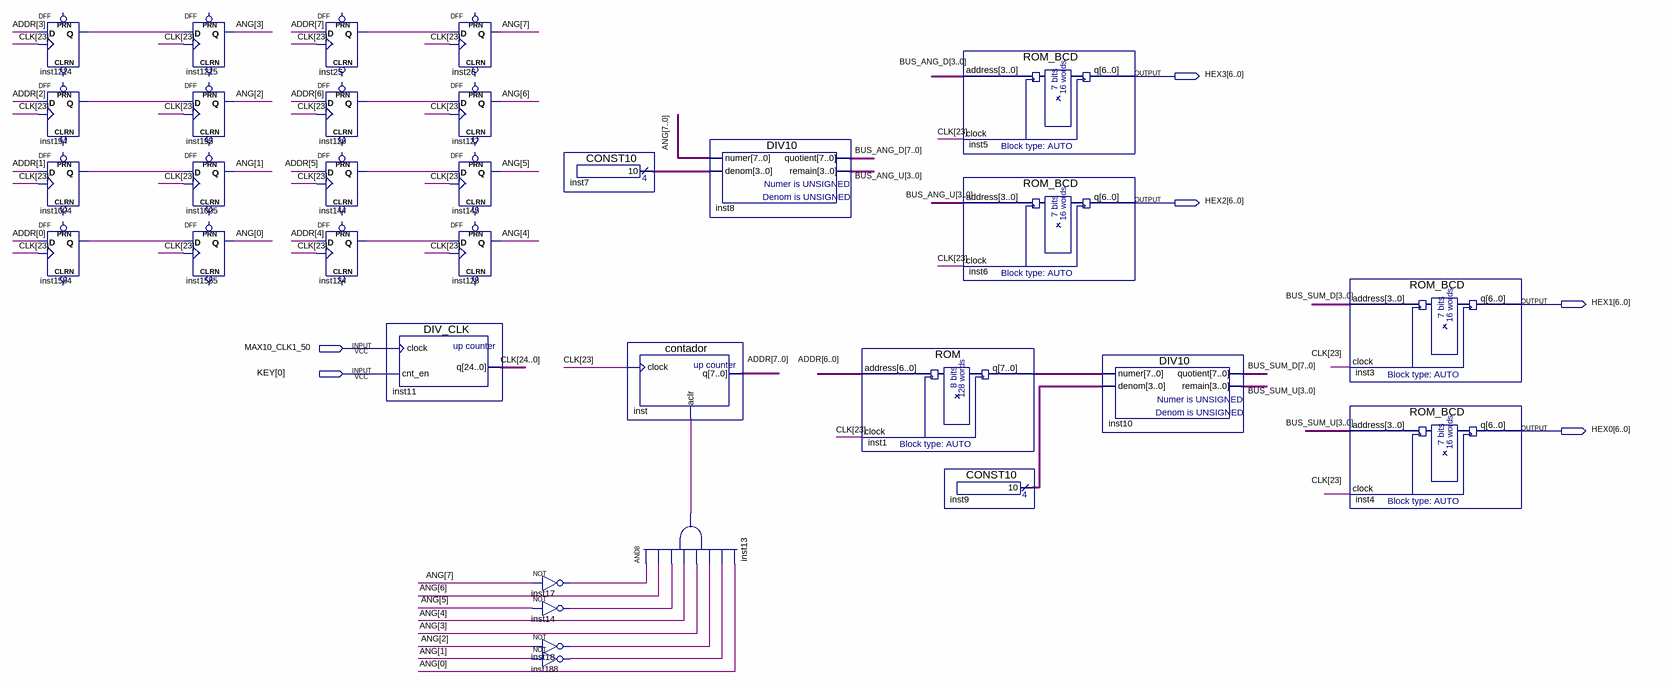
[diagram p0: schematic sheet]
// Quartus schematic sincos.bdf as structural Verilog: 32 symbols, 6 pins
module sincos (
  input  MAX10_CLK1_50,
  input  [0:0] KEY,
  output [6:0] HEX3,
  output [6:0] HEX2,
  output [6:0] HEX1,
  output [6:0] HEX0
);

  wire inst13_out, inst14_out, inst17_out, inst18_out, inst25_q, inst124_q, inst126_q, inst144_q,
       inst188_out, inst194_q, inst1004_q, inst1214_q, inst1554_q;
  wire [3:0] BUS_ANG_U, BUS_SUM_U, inst7_result, inst9_result;
  wire [7:0] ADDR, ANG, BUS_ANG_D, BUS_SUM_D, inst1_q;
  wire [24:0] CLK;

  DFF inst1214 (.CLK(CLK[23]), .D(ADDR[3]), .Q(inst1214_q));  // open: CLRN, PRN
  DFF inst194 (.CLK(CLK[23]), .D(ADDR[2]), .Q(inst194_q));  // open: CLRN, PRN
  DFF inst1004 (.CLK(CLK[23]), .D(ADDR[1]), .Q(inst1004_q));  // open: CLRN, PRN
  DFF inst1554 (.CLK(CLK[23]), .D(ADDR[0]), .Q(inst1554_q));  // open: CLRN, PRN
  DFF inst1215 (.CLK(CLK[23]), .D(inst1214_q), .Q(ANG[3]));  // open: CLRN, PRN
  DFF inst195 (.CLK(CLK[23]), .D(inst194_q), .Q(ANG[2]));  // open: CLRN, PRN
  DFF inst1005 (.CLK(CLK[23]), .D(inst1004_q), .Q(ANG[1]));  // open: CLRN, PRN
  DFF inst1555 (.CLK(CLK[23]), .D(inst1554_q), .Q(ANG[0]));  // open: CLRN, PRN
  DFF inst25 (.CLK(CLK[23]), .D(ADDR[7]), .Q(inst25_q));  // open: CLRN, PRN
  DFF inst126 (.CLK(CLK[23]), .D(ADDR[6]), .Q(inst126_q));  // open: CLRN, PRN
  DFF inst144 (.CLK(CLK[23]), .D(ADDR[5]), .Q(inst144_q));  // open: CLRN, PRN
  DFF inst124 (.CLK(CLK[23]), .D(ADDR[4]), .Q(inst124_q));  // open: CLRN, PRN
  DIV_CLK inst11 (.clock(MAX10_CLK1_50), .cnt_en(KEY[0]), .q(CLK));
  DFF inst26 (.CLK(CLK[23]), .D(inst25_q), .Q(ANG[7]));  // open: CLRN, PRN
  DFF inst127 (.CLK(CLK[23]), .D(inst126_q), .Q(ANG[6]));  // open: CLRN, PRN
  DFF inst145 (.CLK(CLK[23]), .D(inst144_q), .Q(ANG[5]));  // open: CLRN, PRN
  DFF inst125 (.CLK(CLK[23]), .D(inst124_q), .Q(ANG[4]));  // open: CLRN, PRN
  CONST10 inst7 (.result(inst7_result));
  not inst17 (inst17_out, ANG[7]);
  not inst14 (inst14_out, ANG[5]);
  not inst18 (inst18_out, ANG[2]);
  not inst188 (inst188_out, ANG[1]);
  contador inst (.clock(CLK[23]), .aclr(inst13_out), .q(ADDR));
  and inst13 (inst13_out, inst17_out, ANG[6], inst14_out, ANG[4], ANG[3], inst18_out, inst188_out, ANG[0]);
  DIV10 inst8 (.numer(ANG), .denom(inst7_result), .quotient(BUS_ANG_D), .remain(BUS_ANG_U));
  ROM inst1 (.address(ADDR[6:0]), .clock(CLK[23]), .q(inst1_q));
  ROM_BCD inst5 (.address(BUS_ANG_D[3:0]), .clock(CLK[23]), .q(HEX3));
  ROM_BCD inst6 (.address(BUS_ANG_U), .clock(CLK[23]), .q(HEX2));
  CONST10 inst9 (.result(inst9_result));
  DIV10 inst10 (.numer(inst1_q), .denom(inst9_result), .quotient(BUS_SUM_D), .remain(BUS_SUM_U));
  ROM_BCD inst3 (.address(BUS_SUM_D[3:0]), .clock(CLK[23]), .q(HEX1));
  ROM_BCD inst4 (.address(BUS_SUM_U), .clock(CLK[23]), .q(HEX0));
endmodule
